# Altium schematic sheet ESP32_PICO_D4.SchDoc: ESP32_PICO_D4
size A4; ApprovedBy: Baptiste GADEBILLE; CheckedBy: Baptiste GADEBILLE; Author: Clément MANANT; DrawnBy: Clément MANANT; Revision: V1.0 Rev A; SheetNumber: 4; SheetTotal: 5
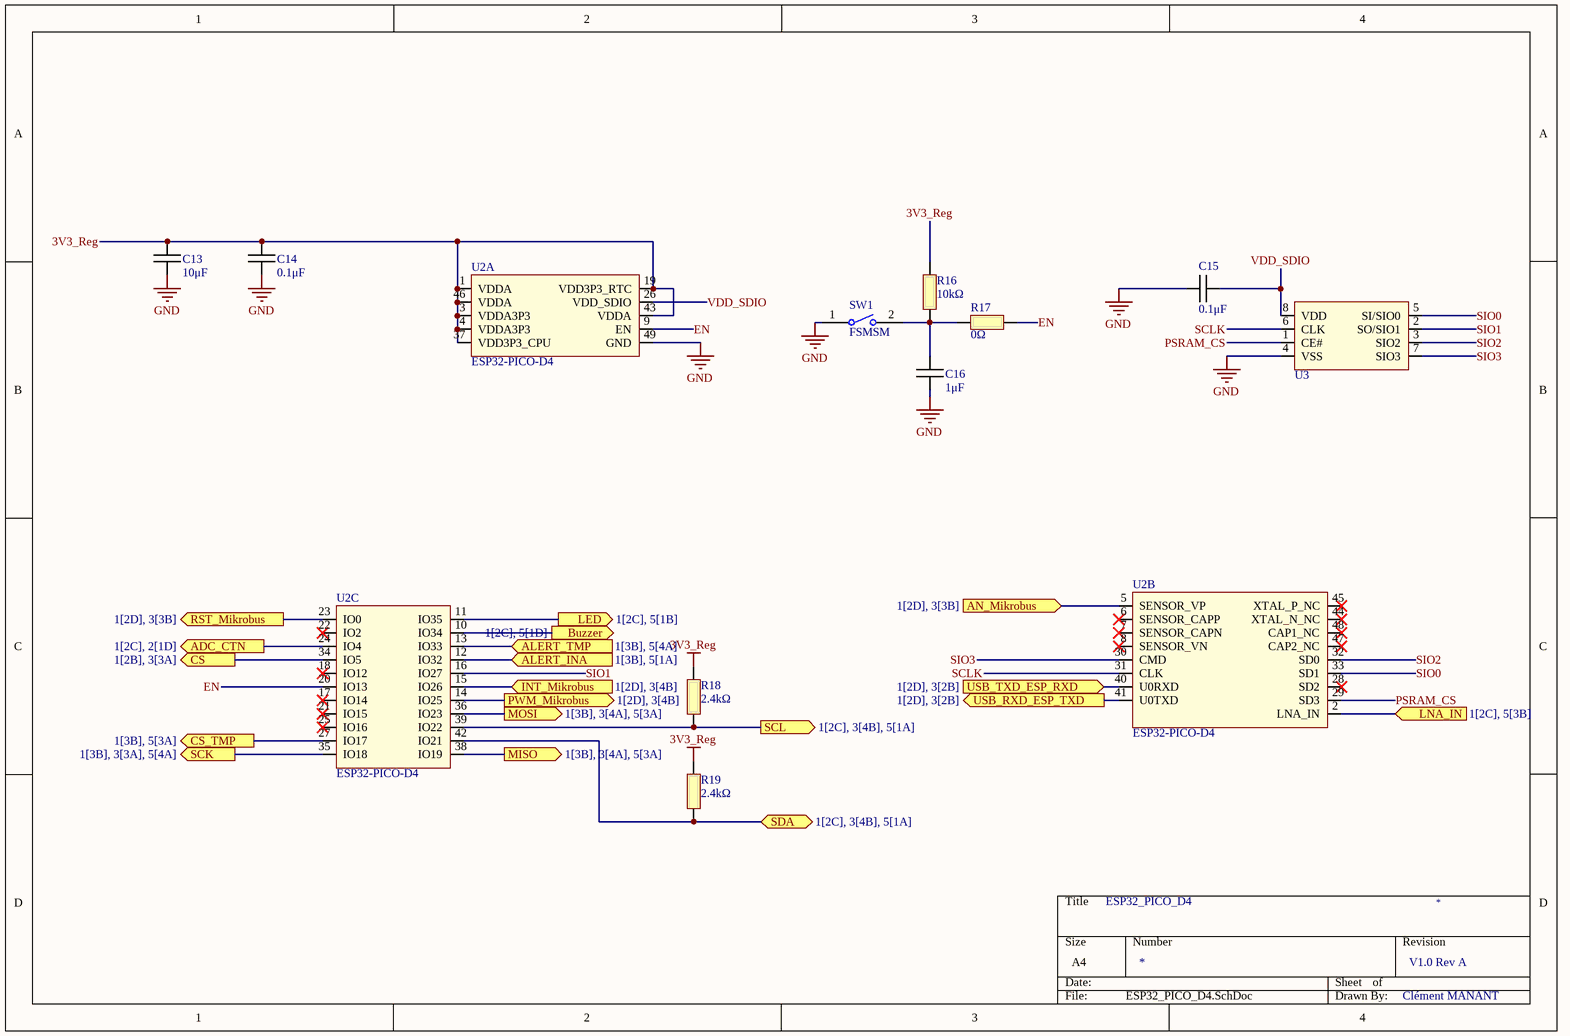
[diagram p0: ESP32_PICO_D4.SchDoc]

## Parts
C13  10μF  [CAPC1005X06N]
C14  0.1μF  [CAPC1005X06N]
C15  0.1μF  [CAPC1005X06N]
C16  1μF  [CAPC1005X06N]
R16  10kΩ  [RESC1005X06N]
R17  0Ω  [RESC1005X06N]
R18  2.4kΩ  [RESC1005X06N]
R19  2.4kΩ  [RESC1005X06N]
SW1  FSMSM  [TECO-FSMSM-2_V]
U2  ESP32-PICO-D4  [PQFN50P700X700X104_HS-49N]  (parts A,B,C of 3)
U3  IS66WVS1M8BLL-104NLI  [SOIC127P600X175-8N]  (value not drawn)

## Ports
ADC_CTN (out, see 1[2C], 2[1D]), ALERT_INA (in, see 1[3B], 5[1A]), ALERT_TMP (in, see 1[3B], 5[4A]), AN_Mikrobus (in, see 1[2D], 3[3B]), Buzzer (out, see 1[2C], 5[1D]), CS (out, see 1[2B], 3[3A]), CS_TMP (out, see 1[3B], 5[3A]), INT_Mikrobus (in, see 1[2D], 3[4B]), LED (out, see 1[2C], 5[1B]), LNA_IN (in, see 1[2C], 5[3B]), MISO (out, see 1[3B], 3[4A], 5[3A]), MOSI (out, see 1[3B], 3[4A], 5[3A]), PWM_Mikrobus (out, see 1[2D], 3[4B]), RST_Mikrobus (out, see 1[2D], 3[3B]), SCK (out, see 1[3B], 3[3A], 5[4A]), SCL (out, see 1[2C], 3[4B], 5[1A]), SDA (bidir, see 1[2C], 3[4B], 5[1A]), USB_RXD_ESP_TXD (out, see 1[2D], 3[2B]), USB_TXD_ESP_RXD (in, see 1[2D], 3[2B])

## Nets
3V3_Reg: C13.1 C14.1 R16.2 R18.2 R19.2 U2.1(VDDA) U2.3(VDDA3P3) U2.4(VDDA3P3) U2.19(VDD3P3_RTC) U2.37(VDD3P3_CPU) U2.43(VDDA) U2.46(VDDA)
GND: C13.2 C14.2 C15.1 C16.2 SW1.1 U2.49(GND) U3.4(VSS)
ADC_CTN: U2.24(IO4) ; port ADC_CTN
ALERT_INA: U2.12(IO32) ; port ALERT_INA
ALERT_TMP: U2.13(IO33) ; port ALERT_TMP
AN_Mikrobus: U2.5(SENSOR_VP) ; port AN_Mikrobus
Buzzer: U2.10(IO34) ; port Buzzer
CS: U2.34(IO5) ; port CS
CS_TMP: U2.27(IO17) ; port CS_TMP
EN: R17.2 U2.9(EN) U2.20(IO13)
INT_Mikrobus: U2.15(IO26) ; port INT_Mikrobus
LED: U2.11(IO35) ; port LED
LNA_IN: U2.2(LNA_IN) ; port LNA_IN
MISO: U2.38(IO19) ; port MISO
MOSI: U2.36(IO23) ; port MOSI
PSRAM_CS: U2.29(SD3) U3.1(CE#)
PWM_Mikrobus: U2.14(IO25) ; port PWM_Mikrobus
RST_Mikrobus: U2.23(IO0) ; port RST_Mikrobus
SCK: U2.35(IO18) ; port SCK
SCL: R18.1 U2.39(IO22) ; port SCL
SCLK: U2.31(CLK) U3.6(CLK)
SDA: R19.1 U2.42(IO21) ; port SDA
SIO0: U2.33(SD1) U3.5(SI/SIO0)
SIO1: U2.16(IO27) U3.2(SO/SIO1)
SIO2: U2.32(SD0) U3.3(SIO2)
SIO3: U2.30(CMD) U3.7(SIO3)
USB_RXD_ESP_TXD: U2.41(U0TXD) ; port USB_RXD_ESP_TXD
USB_TXD_ESP_RXD: U2.40(U0RXD) ; port USB_TXD_ESP_RXD
VDD_SDIO: C15.2 U2.26(VDD_SDIO) U3.8(VDD)
NetC16_1: C16.1 R16.1 R17.1 SW1.2

Not connected (* = marked no-connect by the designer): U2 6(SENSOR_CAPP)* 7(SENSOR_CAPN)* 8(SENSOR_VN)* 17(IO14)* 18(IO12)* 21(IO15)* 22(IO2)* 25(IO16)* 28(SD2)* 44(XTAL_N_NC)* 45(XTAL_P_NC)* 47(CAP2_NC)* 48(CAP1_NC)*

## Library data of the parts
C13-C16 = Capacitor
R16-R19 = Resistor
SW1 = CMP-2000-07511-1: FSMSM Push Button Switch, 50 mA, -35 to 85 degC, 2-Pin SMD, RoHS, Bulk; Manufacturer: TE Connectivity; Actuator Length: 1.07mm; Electrical Life: 20000Cycles; Actuator Material: Polyamide; Current Rating: 50mA; Illumination Type: Illuminated; Voltage Rating (DC): 24V; Contact Resistance: 100mOhm; Case\/Package: SMD/SMT; Operating Force: 180gf; Switch Travel: 0.25mm; Max Voltage Rating (DC): 12V; Throw Configuration: SPST; Packaging: LoosePiece; Max Operating Temperature: 85degC; ELV: Compliant; Package Description: 2-Pin Surface Mount Device, Body 6 x 3.5 mm, Pitch 9.19 mm; RoHSCompliant: true; Manufacturer URL: http://www.te.com/; Contact Plating: Silver; Contact Material: Brass; Mounting Technology: SurfaceMount; Contact Current Rating: 50mA; Datasheet Version: Rev. C2, 08/2014; Datasheet URL: http://www.te.com/commerce/DocumentDelivery/DDEController?Action=showdoc&DocId=Customer+Drawing%7F1437566-3%7FC2%7Fpdf%7FEnglish%7FENG_CD_1437566-3_C2_1437566_3_1_c.dwg.pdf%7F1437566-3; Mechanical Life: 20000Cycles; Package Reference: FSMSM; REACH SVHC: Unknown; Orientation: Straight; Min Operating Temperature: -35degC; Lead Free: LeadFree; Termination: GullWing; Package Quantity: 1000; Mount: SurfaceMount
U2 = ESP32: Système RF sur puce - SoC SIP module ESP32 with 4MByte Flash, Dual Core MCU, Wi-Fi & Bluetooth Combo, LGA48-pin, 7*7mm; Manufacturer 1: Espressif Systems; Supplier 1: Digi-Key; Supplier Part Number 1: 1904-1029-1-ND; Manufacturer Part Number 1: ESP32-PICO-D4
U3 = SRAM: SRAM 8Mb, SerialRAM, 2.7V-3.6V, 104MHz, 8 pin SOIC 150 mil, RoHS; Manufacturer 1: ISSI; Supplier 1: Digi-Key; Supplier Part Number 1: 706-IS66WVS1M8BLL-104NLI-ND; Manufactuer Part Number 1: IS66WVS1M8BLL-104NLI